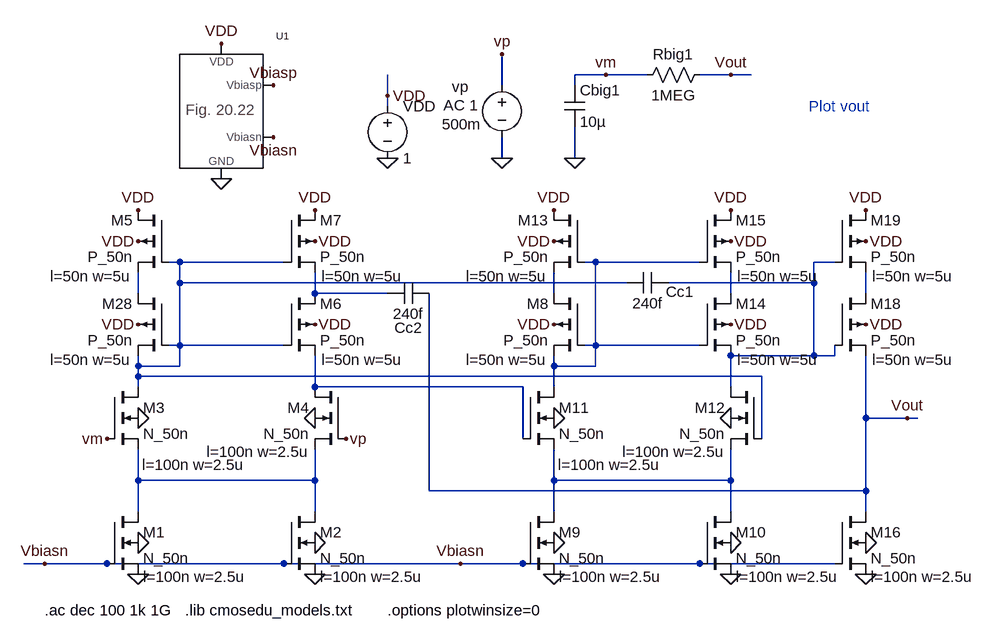
[diagram p0: schematic Fig24_62_AC.asc]
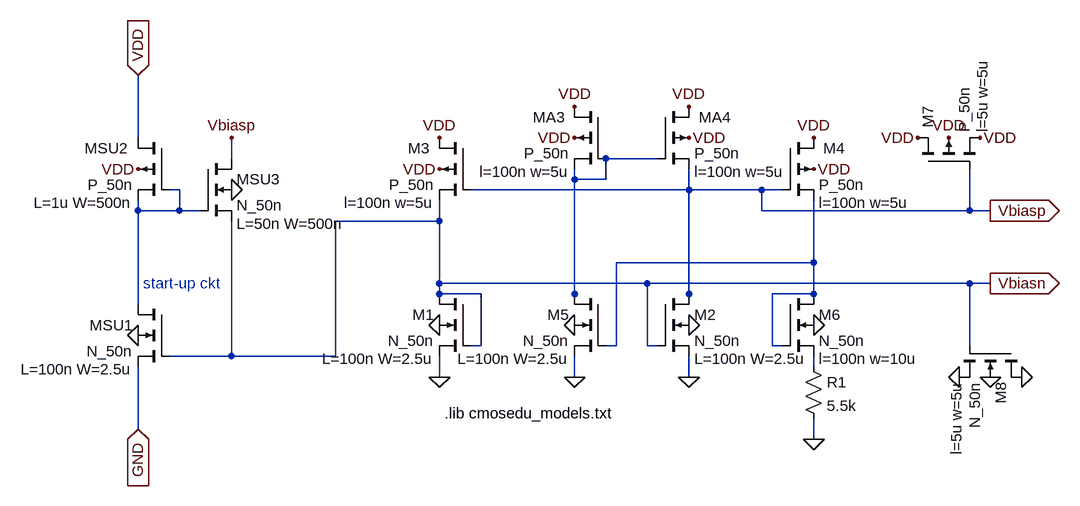
[diagram p1: sub-circuit fig_20_22.asc]
Fig24_62_AC.asc, the LTspice schematic file:
Version 4
SHEET 1 3296 680
WIRE 2528 -1072 2480 -1072
WIRE 2592 -1072 2528 -1072
WIRE 2720 -1072 2672 -1072
WIRE 2752 -1072 2720 -1072
WIRE 2368 -1056 2368 -1104
WIRE 2480 -1056 2480 -1072
WIRE 2192 -1040 2192 -1072
WIRE 2192 -1024 2192 -1040
WIRE 2368 -944 2368 -976
WIRE 2480 -944 2480 -992
WIRE 1872 -784 1856 -784
WIRE 2032 -784 1872 -784
WIRE 2512 -784 2496 -784
WIRE 2672 -784 2512 -784
WIRE 2880 -784 2848 -784
WIRE 1872 -752 1872 -784
WIRE 2560 -752 1872 -752
WIRE 2848 -752 2848 -784
WIRE 2848 -752 2624 -752
WIRE 1808 -736 1808 -768
WIRE 2080 -736 2080 -768
WIRE 2192 -736 2080 -736
WIRE 2448 -736 2448 -768
WIRE 2720 -736 2720 -768
WIRE 2928 -736 2928 -768
WIRE 1872 -656 1872 -752
WIRE 1872 -656 1856 -656
WIRE 2032 -656 1872 -656
WIRE 2512 -656 2512 -784
WIRE 2512 -656 2496 -656
WIRE 2672 -656 2512 -656
WIRE 2848 -640 2848 -752
WIRE 2848 -640 2720 -640
WIRE 2880 -640 2880 -656
WIRE 2880 -640 2848 -640
WIRE 1808 -624 1808 -640
WIRE 1872 -624 1872 -656
WIRE 1872 -624 1808 -624
WIRE 2448 -624 2448 -640
WIRE 2512 -624 2512 -656
WIRE 2512 -624 2448 -624
WIRE 1808 -608 1808 -624
WIRE 2768 -608 1808 -608
WIRE 1808 -592 1808 -608
WIRE 2080 -592 2080 -640
WIRE 2400 -592 2080 -592
WIRE 2448 -592 2448 -624
WIRE 2720 -592 2720 -640
WIRE 2928 -544 2928 -640
WIRE 2992 -544 2928 -544
WIRE 3008 -544 2992 -544
WIRE 2400 -512 2400 -592
WIRE 2768 -512 2768 -608
WIRE 1808 -448 1808 -496
WIRE 2080 -448 2080 -496
WIRE 2080 -448 1808 -448
WIRE 2448 -448 2448 -496
WIRE 2720 -448 2720 -496
WIRE 2720 -448 2448 -448
WIRE 2256 -432 2256 -736
WIRE 2928 -432 2928 -544
WIRE 2928 -432 2256 -432
WIRE 1808 -400 1808 -448
WIRE 2080 -400 2080 -448
WIRE 2448 -400 2448 -448
WIRE 2720 -400 2720 -448
WIRE 2928 -400 2928 -432
WIRE 1664 -320 1632 -320
WIRE 1760 -320 1664 -320
WIRE 2032 -320 1760 -320
WIRE 2304 -320 2032 -320
WIRE 2400 -320 2304 -320
WIRE 2672 -320 2400 -320
WIRE 2880 -320 2672 -320
FLAG 2192 -944 0
FLAG 2192 -1040 VDD
FLAG 2368 -944 0
FLAG 2368 -1104 vp
FLAG 2480 -944 0
FLAG 2720 -1072 Vout
FLAG 2528 -1072 vm
FLAG 1808 -688 VDD
FLAG 1808 -352 0
FLAG 2080 -352 0
FLAG 2080 -304 0
FLAG 1808 -304 0
FLAG 1808 -544 0
FLAG 2080 -544 0
FLAG 1808 -816 VDD
FLAG 2080 -688 VDD
FLAG 2080 -816 VDD
FLAG 1808 -864 VDD
FLAG 2080 -864 VDD
FLAG 1664 -320 Vbiasn
FLAG 2448 -688 VDD
FLAG 2448 -352 0
FLAG 2720 -352 0
FLAG 2720 -304 0
FLAG 2448 -304 0
FLAG 2448 -544 0
FLAG 2720 -544 0
FLAG 2448 -816 VDD
FLAG 2720 -688 VDD
FLAG 2720 -816 VDD
FLAG 2448 -864 VDD
FLAG 2720 -864 VDD
FLAG 2304 -320 Vbiasn
FLAG 2928 -352 0
FLAG 2928 -304 0
FLAG 2928 -688 VDD
FLAG 2928 -816 VDD
FLAG 2928 -864 VDD
FLAG 2992 -544 Vout
FLAG 2128 -512 vp
FLAG 1760 -512 vm
FLAG 1936 -912 0
FLAG 2016 -976 Vbiasn
FLAG 2016 -1056 Vbiasp
FLAG 1936 -1120 VDD
SYMBOL voltage 2192 -1040 R0
WINDOW 123 0 0 Left 0
WINDOW 39 0 0 Left 0
SYMATTR InstName VDD
SYMATTR Value 1
SYMBOL voltage 2368 -1072 R0
WINDOW 0 -77 18 Left 0
WINDOW 3 -92 76 Left 0
WINDOW 123 -90 47 Left 0
WINDOW 39 0 0 Left 0
SYMATTR InstName vp
SYMATTR Value 500m
SYMATTR Value2 AC 1
SYMBOL cap 2464 -1056 R0
SYMATTR InstName Cbig1
SYMATTR Value 10µ
SYMBOL res 2576 -1056 R270
WINDOW 0 32 56 VTop 0
WINDOW 3 0 56 VBottom 0
SYMATTR InstName Rbig1
SYMATTR Value 1MEG
SYMBOL pmos4 1856 -736 M0
WINDOW 123 58 102 Left 0
WINDOW 0 56 16 Left 0
SYMATTR Value2 l=50n w=5u
SYMATTR InstName M28
SYMATTR Value P_50n
SYMBOL nmos4 1760 -400 R0
WINDOW 123 56 100 Left 0
SYMATTR Value2 l=100n w=2.5u
SYMATTR InstName M1
SYMATTR Value N_50n
SYMBOL nmos4 2032 -400 R0
WINDOW 123 56 100 Left 0
SYMATTR Value2 l=100n w=2.5u
SYMATTR InstName M2
SYMATTR Value N_50n
SYMBOL nmos4 1760 -592 R0
WINDOW 123 54 120 Left 0
SYMATTR Value2 l=100n w=2.5u
SYMATTR InstName M3
SYMATTR Value N_50n
SYMBOL nmos4 2128 -592 M0
WINDOW 123 56 100 Left 0
SYMATTR Value2 l=100n w=2.5u
SYMATTR InstName M4
SYMATTR Value N_50n
SYMBOL pmos4 1856 -864 M0
WINDOW 123 58 102 Left 0
WINDOW 0 56 16 Left 0
SYMATTR Value2 l=50n w=5u
SYMATTR InstName M5
SYMATTR Value P_50n
SYMBOL pmos4 2032 -736 R0
WINDOW 123 58 102 Left 0
WINDOW 0 56 16 Left 0
SYMATTR Value2 l=50n w=5u
SYMATTR InstName M6
SYMATTR Value P_50n
SYMBOL pmos4 2032 -864 R0
WINDOW 123 58 102 Left 0
WINDOW 0 56 16 Left 0
SYMATTR Value2 l=50n w=5u
SYMATTR InstName M7
SYMATTR Value P_50n
SYMBOL pmos4 2496 -736 M0
WINDOW 123 58 102 Left 0
WINDOW 0 56 16 Left 0
SYMATTR Value2 l=50n w=5u
SYMATTR InstName M8
SYMATTR Value P_50n
SYMBOL nmos4 2400 -400 R0
WINDOW 123 56 100 Left 0
SYMATTR Value2 l=100n w=2.5u
SYMATTR InstName M9
SYMATTR Value N_50n
SYMBOL nmos4 2672 -400 R0
WINDOW 123 56 100 Left 0
SYMATTR Value2 l=100n w=2.5u
SYMATTR InstName M10
SYMATTR Value N_50n
SYMBOL nmos4 2400 -592 R0
WINDOW 123 54 120 Left 0
SYMATTR Value2 l=100n w=2.5u
SYMATTR InstName M11
SYMATTR Value N_50n
SYMBOL nmos4 2768 -592 M0
WINDOW 123 56 100 Left 0
SYMATTR Value2 l=100n w=2.5u
SYMATTR InstName M12
SYMATTR Value N_50n
SYMBOL pmos4 2496 -864 M0
WINDOW 123 58 102 Left 0
WINDOW 0 56 16 Left 0
SYMATTR Value2 l=50n w=5u
SYMATTR InstName M13
SYMATTR Value P_50n
SYMBOL pmos4 2672 -736 R0
WINDOW 123 58 102 Left 0
WINDOW 0 56 16 Left 0
SYMATTR Value2 l=50n w=5u
SYMATTR InstName M14
SYMATTR Value P_50n
SYMBOL pmos4 2672 -864 R0
WINDOW 123 58 102 Left 0
WINDOW 0 56 16 Left 0
SYMATTR Value2 l=50n w=5u
SYMATTR InstName M15
SYMATTR Value P_50n
SYMBOL nmos4 2880 -400 R0
WINDOW 123 56 100 Left 0
SYMATTR Value2 l=100n w=2.5u
SYMATTR InstName M16
SYMATTR Value N_50n
SYMBOL pmos4 2880 -736 R0
WINDOW 123 58 102 Left 0
WINDOW 0 56 16 Left 0
SYMATTR Value2 l=50n w=5u
SYMATTR InstName M18
SYMATTR Value P_50n
SYMBOL pmos4 2880 -864 R0
WINDOW 123 58 102 Left 0
WINDOW 0 56 16 Left 0
SYMATTR Value2 l=50n w=5u
SYMATTR InstName M19
SYMATTR Value P_50n
SYMBOL cap 2624 -768 R90
WINDOW 0 45 -18 VBottom 0
WINDOW 3 32 32 VTop 0
SYMATTR InstName Cc1
SYMATTR Value 240f
SYMBOL cap 2256 -752 R90
WINDOW 0 85 32 VBottom 0
WINDOW 3 32 32 VTop 0
SYMATTR InstName Cc2
SYMATTR Value 240f
SYMBOL Fig_20_22 1872 -1008 R0
SYMATTR InstName U1
TEXT 1880 -248 Left 0 !.lib cmosedu_models.txt
TEXT 1664 -248 Left 0 !.ac dec 100 1k 1G
TEXT 2840 -1024 Left 0 ;Plot vout
TEXT 2192 -248 Left 0 !.options plotwinsize=0

fig_20_22.asc, the sub-circuit schematic file:
Version 4
SHEET 1 1996 680
WIRE 544 -176 544 -272
WIRE 544 -64 544 -80
WIRE 544 80 544 -64
WIRE 544 272 544 176
WIRE 608 -96 592 -96
WIRE 608 -64 544 -64
WIRE 608 -64 608 -96
WIRE 640 -64 608 -64
WIRE 688 -144 688 -176
WIRE 688 160 592 160
WIRE 688 160 688 -48
WIRE 848 160 688 160
WIRE 848 160 848 -48
WIRE 1008 -48 848 -48
WIRE 1008 -48 1008 -80
WIRE 1008 48 1008 -48
WIRE 1008 64 1008 48
WIRE 1008 192 1008 160
WIRE 1072 64 1008 64
WIRE 1072 144 1056 144
WIRE 1072 144 1072 64
WIRE 1216 -112 1216 -128
WIRE 1216 64 1216 -112
WIRE 1216 80 1216 64
WIRE 1216 192 1216 160
WIRE 1264 -112 1216 -112
WIRE 1264 -112 1264 -144
WIRE 1280 144 1264 144
WIRE 1280 144 1280 16
WIRE 1328 48 1008 48
WIRE 1328 144 1328 48
WIRE 1344 -144 1264 -144
WIRE 1344 144 1328 144
WIRE 1392 -96 1056 -96
WIRE 1392 -96 1392 -128
WIRE 1392 64 1392 -96
WIRE 1392 80 1392 64
WIRE 1392 192 1392 160
WIRE 1504 -96 1392 -96
WIRE 1504 -64 1504 -96
WIRE 1520 144 1520 64
WIRE 1536 -96 1504 -96
WIRE 1536 144 1520 144
WIRE 1584 16 1280 16
WIRE 1584 16 1584 -80
WIRE 1584 64 1520 64
WIRE 1584 64 1584 16
WIRE 1584 176 1584 160
WIRE 1584 288 1584 256
WIRE 1824 -64 1504 -64
WIRE 1824 -64 1824 -128
WIRE 1824 48 1328 48
WIRE 1824 144 1824 48
WIRE 1856 -64 1824 -64
WIRE 1856 48 1824 48
FLAG 544 -128 VDD
FLAG 688 -176 Vbiasp
FLAG 1008 -128 VDD
FLAG 1008 -176 VDD
FLAG 1584 -128 VDD
FLAG 1584 -176 VDD
FLAG 1584 288 0
FLAG 1584 112 0
FLAG 1392 -176 VDD
FLAG 1392 -224 VDD
FLAG 1216 -176 VDD
FLAG 1216 -224 VDD
FLAG 1392 112 0
FLAG 1792 -176 VDD
FLAG 1744 -176 VDD
FLAG 1840 -176 VDD
FLAG 544 -272 VDD
IOPIN 544 -272 In
FLAG 544 272 GND
IOPIN 544 272 In
FLAG 688 -96 0
FLAG 544 128 0
FLAG 1008 192 0
FLAG 1008 112 0
FLAG 1216 112 0
FLAG 1216 192 0
FLAG 1856 192 0
FLAG 1904 192 0
FLAG 1808 192 0
FLAG 1392 192 0
FLAG 1856 -64 Vbiasp
IOPIN 1856 -64 Out
FLAG 1856 48 Vbiasn
IOPIN 1856 48 Out
SYMBOL pmos4 592 -176 M0
WINDOW 0 63 16 Left 0
WINDOW 123 56 100 Left 0
SYMATTR InstName MSU2
SYMATTR Value2 L=1u W=500n
SYMATTR Value P_50n
SYMBOL nmos4 592 80 M0
WINDOW 123 56 100 Left 0
SYMATTR Value2 L=100n W=2.5u
SYMATTR InstName MSU1
SYMATTR Value N_50n
SYMBOL nmos4 640 -144 R0
WINDOW 123 56 100 Left 0
SYMATTR Value2 L=50n W=500n
SYMATTR InstName MSU3
SYMATTR Value N_50n
SYMBOL pmos4 1056 -176 M0
WINDOW 0 63 16 Left 0
WINDOW 123 56 100 Left 0
SYMATTR InstName M3
SYMATTR Value2 l=100n w=5u
SYMATTR Value P_50n
SYMBOL pmos4 1536 -176 R0
WINDOW 0 63 16 Left 0
WINDOW 123 56 100 Left 0
SYMATTR InstName M4
SYMATTR Value2 l=100n w=5u
SYMATTR Value P_50n
SYMBOL nmos4 1056 64 M0
WINDOW 123 56 100 Left 0
SYMATTR Value2 L=100n W=2.5u
SYMATTR InstName M1
SYMATTR Value N_50n
SYMBOL res 1568 160 R0
SYMATTR InstName R1
SYMATTR Value 5.5k
SYMBOL pmos4 1344 -224 R0
WINDOW 0 63 16 Left 0
WINDOW 123 56 100 Left 0
SYMATTR InstName MA4
SYMATTR Value2 l=100n w=5u
SYMATTR Value P_50n
SYMBOL pmos4 1264 -224 M0
WINDOW 0 63 16 Left 0
WINDOW 123 56 100 Left 0
SYMATTR InstName MA3
SYMATTR Value2 l=100n w=5u
SYMATTR Value P_50n
SYMBOL nmos4 1264 64 M0
WINDOW 123 56 100 Left 0
SYMATTR Value2 L=100n W=2.5u
SYMATTR InstName M5
SYMATTR Value N_50n
SYMBOL pmos4 1744 -128 R270
WINDOW 0 63 16 Left 0
WINDOW 123 56 100 Left 0
SYMATTR InstName M7
SYMATTR Value2 l=5u w=5u
SYMATTR Value P_50n
SYMBOL nmos4 1904 144 R90
WINDOW 123 56 100 Left 0
SYMATTR Value2 l=5u w=5u
SYMATTR InstName M8
SYMATTR Value N_50n
SYMBOL nmos4 1344 64 R0
WINDOW 123 56 100 Left 0
SYMATTR Value2 L=100n W=2.5u
SYMATTR InstName M2
SYMATTR Value N_50n
SYMBOL nmos4 1536 64 R0
WINDOW 123 56 100 Left 0
SYMATTR Value2 l=100n w=10u
SYMATTR InstName M6
SYMATTR Value N_50n
TEXT 552 48 Left 0 ;start-up ckt
TEXT 1016 248 Left 0 !.lib cmosedu_models.txt

The netlist it stands for:
* Fig24_62_AC.asc
VDD VDD 0 1
vp vp 0 500m AC 1
Cbig1 vm 0 10µ
Rbig1 vm Vout 1MEG
M28 N004 N001 N001 VDD P_50n l=50n w=5u
M1 N010 Vbiasn 0 0 N_50n l=100n w=2.5u
M2 N010 Vbiasn 0 0 N_50n l=100n w=2.5u
M3 N001 vm N010 0 N_50n l=100n w=2.5u
M4 N009 vp N010 0 N_50n l=100n w=2.5u
M5 VDD N001 N004 VDD P_50n l=50n w=5u
M6 N005 N001 N009 VDD P_50n l=50n w=5u
M7 VDD N001 N005 VDD P_50n l=50n w=5u
M8 N006 N002 N002 VDD P_50n l=50n w=5u
M9 N011 Vbiasn 0 0 N_50n l=100n w=2.5u
M10 N011 Vbiasn 0 0 N_50n l=100n w=2.5u
M11 N002 N009 N011 0 N_50n l=100n w=2.5u
M12 N003 N001 N011 0 N_50n l=100n w=2.5u
M13 VDD N002 N006 VDD P_50n l=50n w=5u
M14 N007 N002 N003 VDD P_50n l=50n w=5u
M15 VDD N002 N007 VDD P_50n l=50n w=5u
M16 Vout Vbiasn 0 0 N_50n l=100n w=2.5u
M18 N008 N003 Vout VDD P_50n l=50n w=5u
M19 VDD N003 N008 VDD P_50n l=50n w=5u
Cc1 N003 N001 240f
Cc2 Vout N005 240f
XU1 Vbiasn Vbiasp VDD 0 fig_20_22

* block symbol definitions
.subckt fig_20_22 Vbiasn Vbiasp VDD GND
MSU2 VDD N001 N001 VDD P_50n L=1u W=500n
MSU1 N001 Vbiasn GND 0 N_50n L=100n W=2.5u
MSU3 Vbiasp N001 Vbiasn 0 N_50n L=50n W=500n
M3 VDD Vbiasp Vbiasn VDD P_50n l=100n w=5u
M4 VDD Vbiasp N003 VDD P_50n l=100n w=5u
M1 Vbiasn Vbiasn 0 0 N_50n L=100n W=2.5u
R1 N004 0 5.5k
MA4 VDD N002 Vbiasp VDD P_50n l=100n w=5u
MA3 VDD N002 N002 VDD P_50n l=100n w=5u
M5 N002 N003 0 0 N_50n L=100n W=2.5u
M7 VDD Vbiasp VDD VDD P_50n l=5u w=5u
M8 0 Vbiasn 0 0 N_50n l=5u w=5u
M2 Vbiasp Vbiasn 0 0 N_50n L=100n W=2.5u
M6 N003 N003 N004 0 N_50n l=100n w=10u
* start-up ckt
.lib cmosedu_models.txt
.ends fig_20_22

.model NMOS NMOS
.model PMOS PMOS
.lib standard.mos
.lib cmosedu_models.txt
.ac dec 100 1k 1G
* Plot vout
.options plotwinsize=0
.backanno
.end